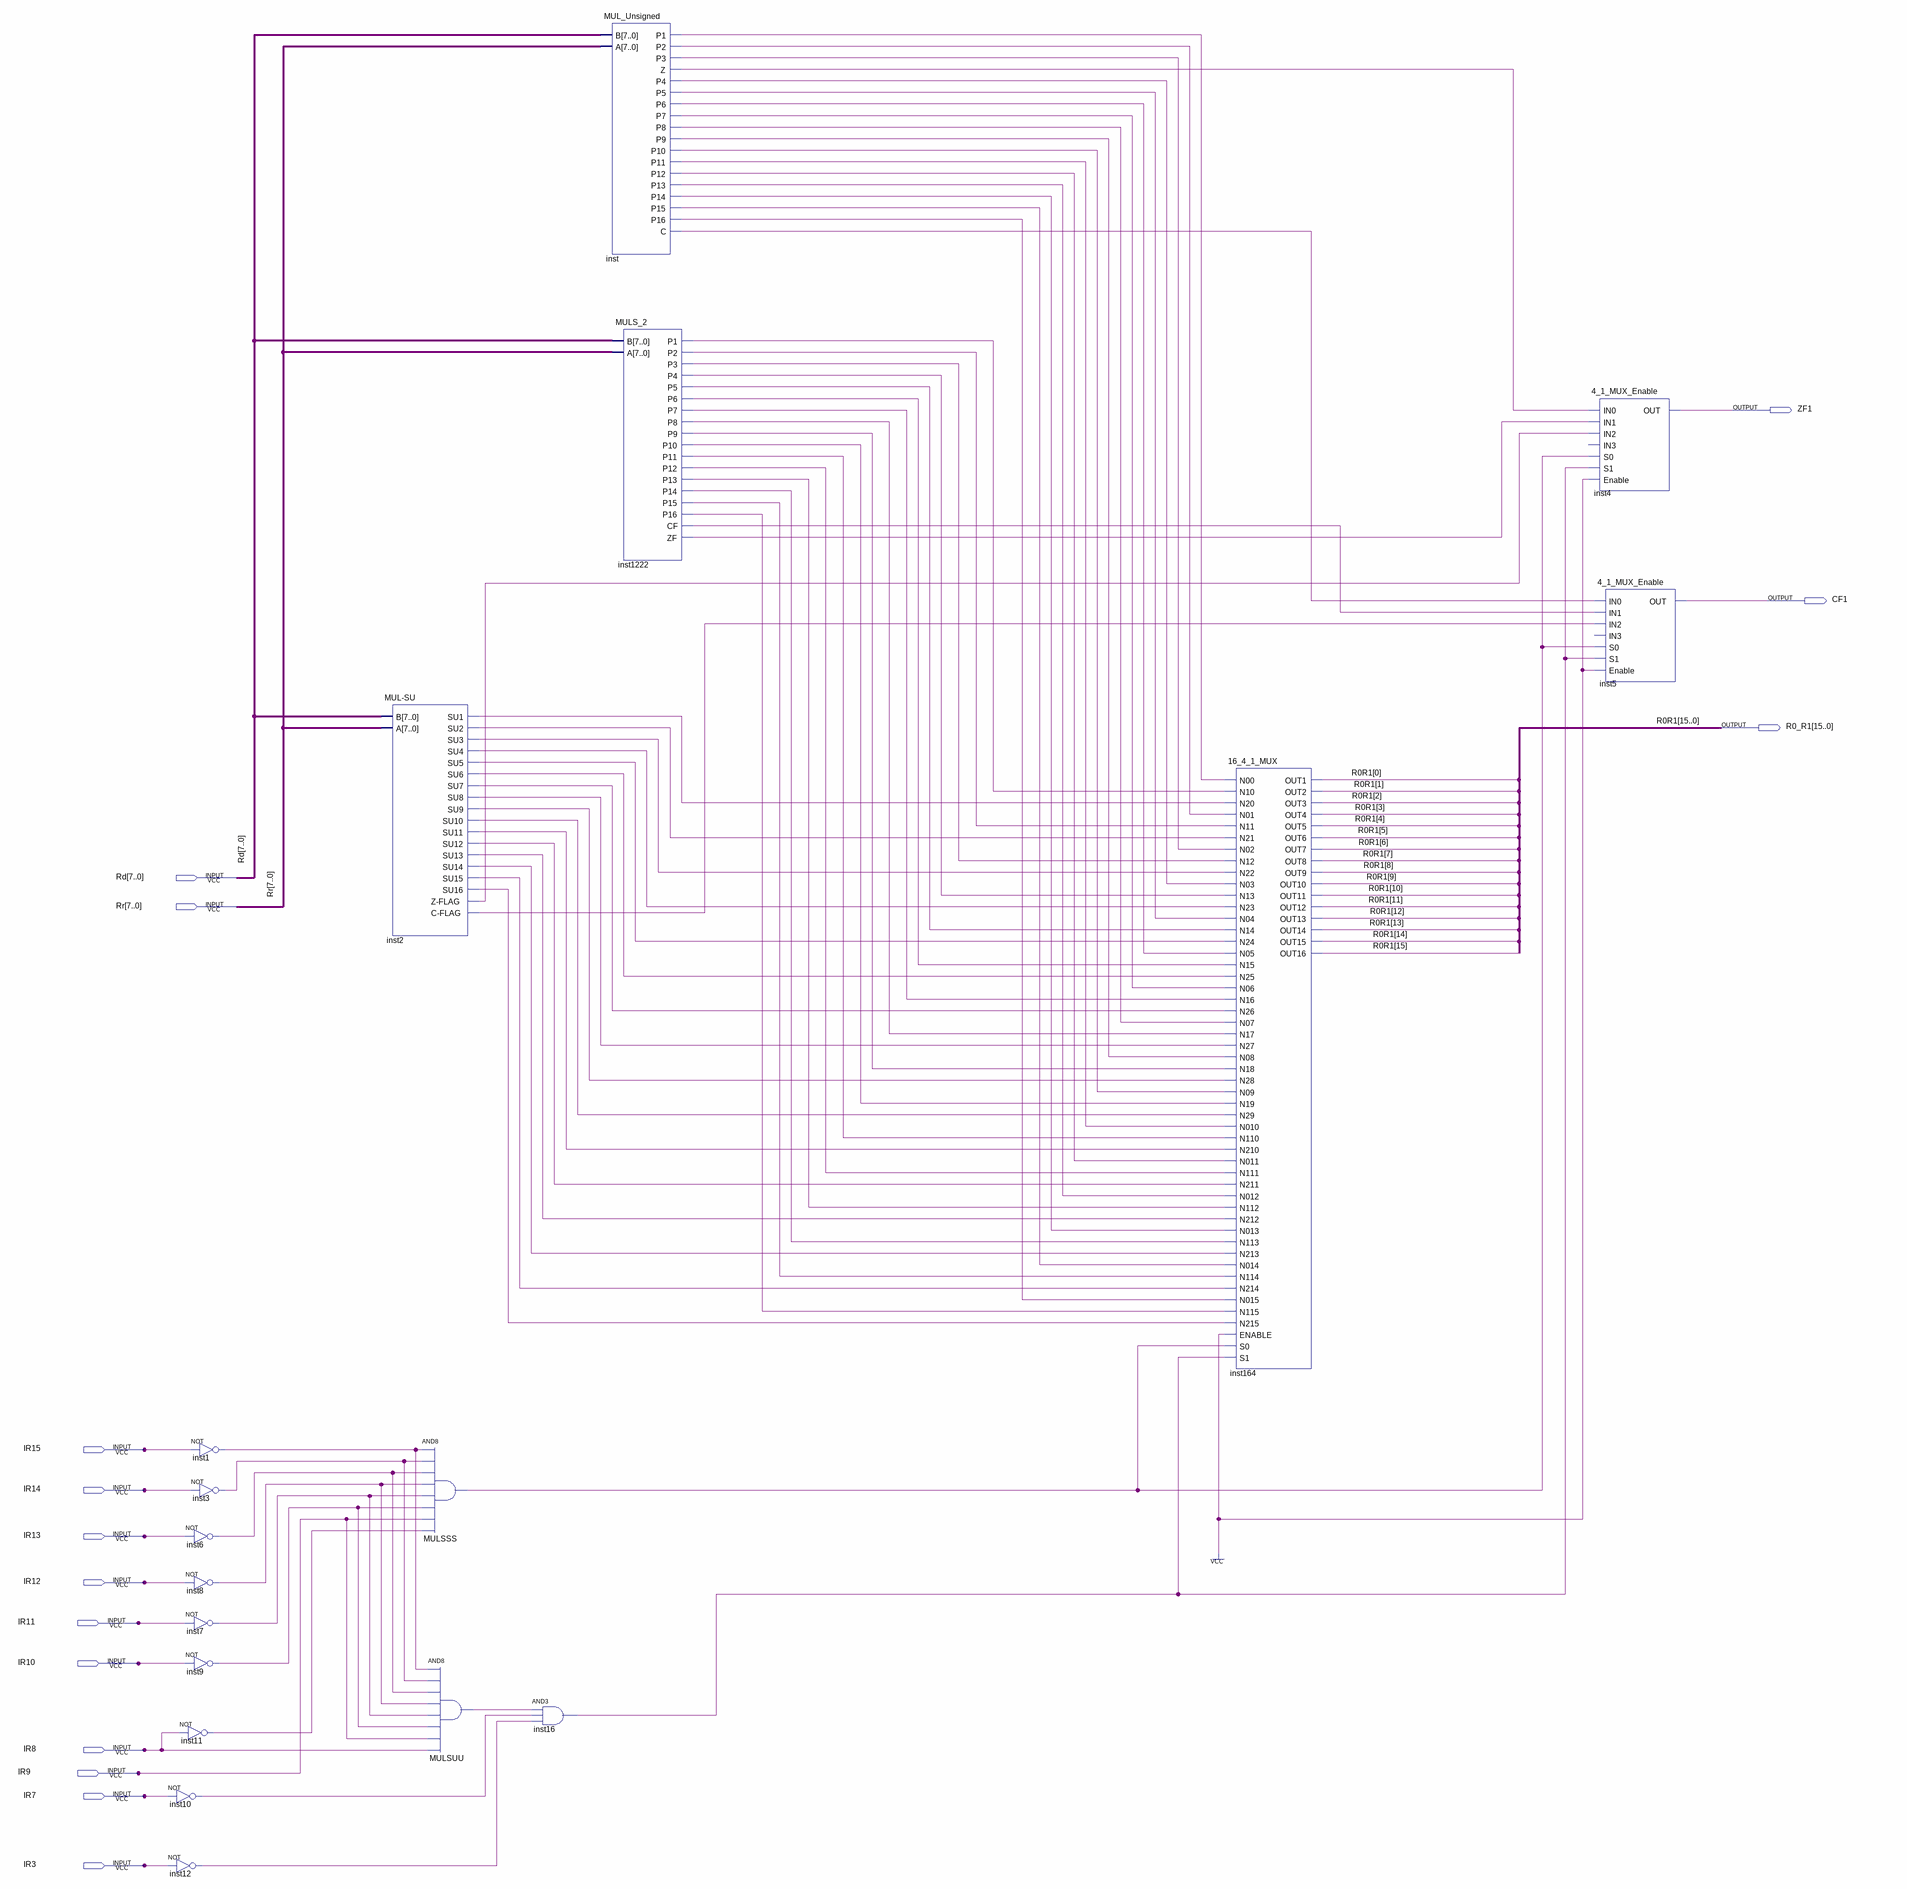
[diagram p0: schematic sheet]
// Quartus schematic MUL_ALU.bdf as structural Verilog: 18 symbols, 15 pins
module MUL_ALU (
  input  [7:0] Rd,
  input  [7:0] Rr,
  input  IR15,
  input  IR14,
  input  IR13,
  input  IR12,
  input  IR11,
  input  IR10,
  input  IR8,
  input  IR9,
  input  IR7,
  input  IR3,
  output ZF1,
  output CF1,
  output [15:0] R0_R1
);

  wire inst1_out, inst2_c_flag, inst2_su1, inst2_su2, inst2_su3, inst2_su4, inst2_su5, inst2_su6, inst2_su7,
       inst2_su8, inst2_su9, inst2_su10, inst2_su11, inst2_su12, inst2_su13, inst2_su14, inst2_su15,
       inst2_su16, inst2_z_flag, inst3_out, inst6_out, inst7_out, inst8_out, inst9_out, inst10_out,
       inst11_out, inst12_out, inst16_out, inst1222_cf, inst1222_p1, inst1222_p2, inst1222_p3, inst1222_p4,
       inst1222_p5, inst1222_p6, inst1222_p7, inst1222_p8, inst1222_p9, inst1222_p10, inst1222_p11,
       inst1222_p12, inst1222_p13, inst1222_p14, inst1222_p15, inst1222_p16, inst1222_zf, inst_c, inst_p1,
       inst_p2, inst_p3, inst_p4, inst_p5, inst_p6, inst_p7, inst_p8, inst_p9, inst_p10, inst_p11, inst_p12,
       inst_p13, inst_p14, inst_p15, inst_p16, inst_z, MULSSS_out, MULSUU_out;

  not inst1 (inst1_out, IR15);
  not inst3 (inst3_out, IR14);
  not inst6 (inst6_out, IR13);
  not inst8 (inst8_out, IR12);
  not inst7 (inst7_out, IR11);
  not inst9 (inst9_out, IR10);
  not inst11 (inst11_out, IR8);
  not inst10 (inst10_out, IR7);
  not inst12 (inst12_out, IR3);
  \MUL-SU  inst2 (
    .B(Rd), .A(Rr), .SU1(inst2_su1), .SU2(inst2_su2), .SU3(inst2_su3), .SU4(inst2_su4), .SU5(inst2_su5),
    .SU6(inst2_su6), .SU7(inst2_su7), .SU8(inst2_su8), .SU9(inst2_su9), .SU10(inst2_su10), .SU11(inst2_su11),
    .SU12(inst2_su12), .SU13(inst2_su13), .SU14(inst2_su14), .SU15(inst2_su15), .SU16(inst2_su16),
    .\Z-FLAG (inst2_z_flag), .\C-FLAG (inst2_c_flag));
  and MULSSS (MULSSS_out, inst1_out, inst3_out, inst6_out, inst8_out, inst7_out, inst9_out, IR9, inst11_out);
  and MULSUU (MULSUU_out, inst1_out, inst3_out, inst6_out, inst8_out, inst7_out, inst9_out, IR9, IR8);
  and inst16 (inst16_out, MULSUU_out, inst10_out, inst12_out);
  MUL_Unsigned inst (
    .B(Rd), .A(Rr), .P1(inst_p1), .P2(inst_p2), .P3(inst_p3), .Z(inst_z), .P4(inst_p4), .P5(inst_p5),
    .P6(inst_p6), .P7(inst_p7), .P8(inst_p8), .P9(inst_p9), .P10(inst_p10), .P11(inst_p11), .P12(inst_p12),
    .P13(inst_p13), .P14(inst_p14), .P15(inst_p15), .P16(inst_p16), .C(inst_c));
  MULS_2 inst1222 (
    .B(Rd), .A(Rr), .P1(inst1222_p1), .P2(inst1222_p2), .P3(inst1222_p3), .P4(inst1222_p4), .P5(inst1222_p5),
    .P6(inst1222_p6), .P7(inst1222_p7), .P8(inst1222_p8), .P9(inst1222_p9), .P10(inst1222_p10),
    .P11(inst1222_p11), .P12(inst1222_p12), .P13(inst1222_p13), .P14(inst1222_p14), .P15(inst1222_p15),
    .P16(inst1222_p16), .CF(inst1222_cf), .ZF(inst1222_zf));
  \16_4_1_MUX  inst164 (
    .N00(inst_p1), .N10(inst1222_p1), .N20(inst2_su1), .N01(inst_p2), .N11(inst1222_p2), .N21(inst2_su2),
    .N02(inst_p3), .N12(inst1222_p3), .N22(inst2_su3), .N03(inst_p4), .N13(inst1222_p4), .N23(inst2_su4),
    .N04(inst_p5), .N14(inst1222_p5), .N24(inst2_su5), .N05(inst_p6), .N15(inst1222_p6), .N25(inst2_su6),
    .N06(inst_p7), .N16(inst1222_p7), .N26(inst2_su7), .N07(inst_p8), .N17(inst1222_p8), .N27(inst2_su8),
    .N08(inst_p9), .N18(inst1222_p9), .N28(inst2_su9), .N09(inst_p10), .N19(inst1222_p10), .N29(inst2_su10),
    .N010(inst_p11), .N110(inst1222_p11), .N210(inst2_su11), .N011(inst_p12), .N111(inst1222_p12),
    .N211(inst2_su12), .N012(inst_p13), .N112(inst1222_p13), .N212(inst2_su13), .N013(inst_p14),
    .N113(inst1222_p14), .N213(inst2_su14), .N014(inst_p15), .N114(inst1222_p15), .N214(inst2_su15),
    .N015(inst_p16), .N115(inst1222_p16), .N215(inst2_su16), .ENABLE(1'b1), .S0(MULSSS_out), .S1(inst16_out),
    .OUT1(R0_R1[0]), .OUT2(R0_R1[1]), .OUT3(R0_R1[2]), .OUT4(R0_R1[3]), .OUT5(R0_R1[4]), .OUT6(R0_R1[5]),
    .OUT7(R0_R1[6]), .OUT8(R0_R1[7]), .OUT9(R0_R1[8]), .OUT10(R0_R1[9]), .OUT11(R0_R1[10]),
    .OUT12(R0_R1[11]), .OUT13(R0_R1[12]), .OUT14(R0_R1[13]), .OUT15(R0_R1[14]), .OUT16(R0_R1[15]));
  \4_1_MUX_Enable  inst4 (
    .IN0(inst_z), .IN1(inst1222_zf), .IN2(inst2_z_flag), .S0(MULSSS_out), .S1(inst16_out), .Enable(1'b1),
    .OUT(ZF1));  // open: IN3
  \4_1_MUX_Enable  inst5 (
    .IN0(inst_c), .IN1(inst1222_cf), .IN2(inst2_c_flag), .S0(MULSSS_out), .S1(inst16_out), .Enable(1'b1),
    .OUT(CF1));  // open: IN3

  // Other names for the same wires on the sheet: R0R1[15:0] = R0_R1
endmodule
